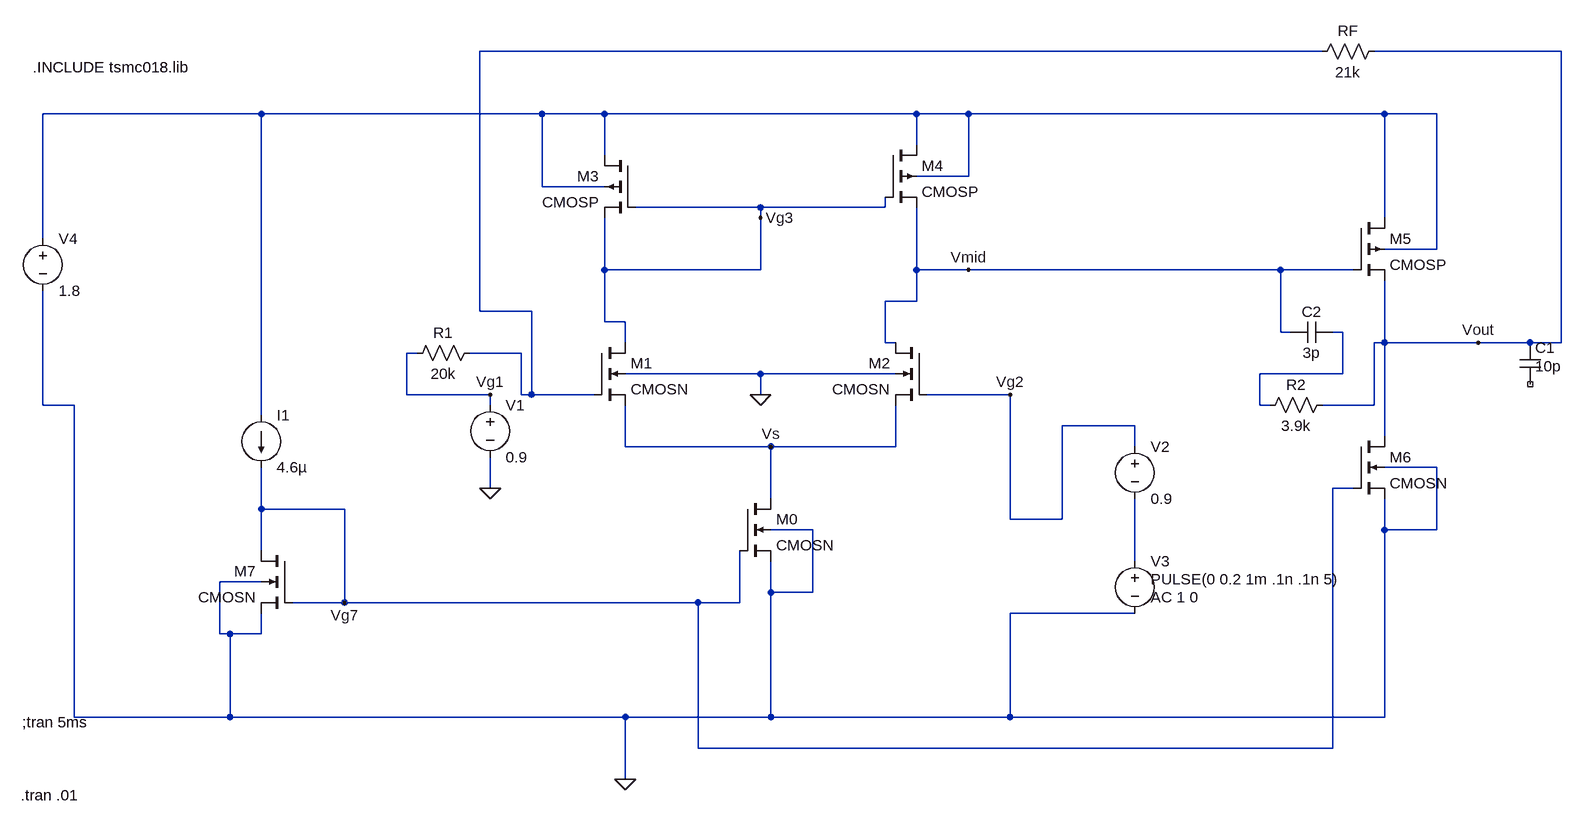
[diagram p0: schematic 2_stage_ota_240102074_closed_loop.asc]
2_stage_ota_240102074_closed_loop.asc, the LTspice schematic file:
Version 4
SHEET 1 2884 1176
WIRE 1696 16 400 16
WIRE 2064 16 1776 16
WIRE 64 112 -272 112
WIRE 496 112 64 112
WIRE 592 112 496 112
WIRE 1072 112 592 112
WIRE 1152 112 1072 112
WIRE 1792 112 1152 112
WIRE 1872 112 1792 112
WIRE 1072 160 1072 112
WIRE 592 176 592 112
WIRE 1152 208 1152 112
WIRE 1152 208 1072 208
WIRE 496 224 496 112
WIRE 592 224 496 224
WIRE 832 256 640 256
WIRE 1024 256 1024 240
WIRE 1024 256 832 256
WIRE 832 272 832 256
WIRE 1792 272 1792 112
WIRE -272 304 -272 112
WIRE 1872 320 1872 112
WIRE 1872 320 1792 320
WIRE 592 352 592 272
WIRE 832 352 832 272
WIRE 832 352 592 352
WIRE 1072 352 1072 256
WIRE 1152 352 1072 352
WIRE 1632 352 1152 352
WIRE 1744 352 1632 352
WIRE 1072 400 1072 352
WIRE 1072 400 1024 400
WIRE 400 416 400 16
WIRE 480 416 400 416
WIRE 592 432 592 352
WIRE 624 432 592 432
WIRE 1632 448 1632 352
WIRE 1648 448 1632 448
WIRE 1728 448 1712 448
WIRE 624 464 624 432
WIRE 1024 464 1024 400
WIRE 1040 464 1024 464
WIRE 1792 464 1792 368
WIRE 1792 464 1776 464
WIRE 1936 464 1792 464
WIRE 2016 464 1936 464
WIRE 2064 464 2064 16
WIRE 2064 464 2016 464
WIRE 304 480 288 480
WIRE 464 480 384 480
WIRE 832 512 624 512
WIRE 1040 512 832 512
WIRE 1728 512 1728 448
WIRE 1728 512 1600 512
WIRE 288 544 288 480
WIRE 416 544 288 544
WIRE 464 544 464 480
WIRE 480 544 480 416
WIRE 480 544 464 544
WIRE 576 544 480 544
WIRE 832 544 832 512
WIRE 1216 544 1088 544
WIRE -272 560 -272 384
WIRE -224 560 -272 560
WIRE 416 560 416 544
WIRE 1600 560 1600 512
WIRE 1616 560 1600 560
WIRE 1776 560 1776 464
WIRE 1776 560 1696 560
WIRE 64 576 64 112
WIRE 1408 592 1296 592
WIRE 1792 608 1792 464
WIRE 624 624 624 560
WIRE 848 624 624 624
WIRE 1040 624 1040 560
WIRE 1040 624 848 624
WIRE 1408 624 1408 592
WIRE 1872 656 1792 656
WIRE 416 688 416 640
WIRE 1744 688 1712 688
WIRE 848 704 848 624
WIRE 64 720 64 656
WIRE 192 720 64 720
WIRE 1216 736 1216 544
WIRE 1296 736 1296 592
WIRE 1296 736 1216 736
WIRE 912 752 848 752
WIRE 1792 752 1792 704
WIRE 1872 752 1872 656
WIRE 1872 752 1792 752
WIRE 64 784 64 720
WIRE 1408 800 1408 704
WIRE 64 832 0 832
WIRE 848 848 848 800
WIRE 912 848 912 752
WIRE 912 848 848 848
WIRE 192 864 192 720
WIRE 192 864 112 864
WIRE 736 864 192 864
WIRE 800 864 800 784
WIRE 800 864 736 864
WIRE 1408 880 1216 880
WIRE 0 912 0 832
WIRE 16 912 0 912
WIRE 64 912 64 880
WIRE 64 912 16 912
WIRE -224 1040 -224 560
WIRE 16 1040 16 912
WIRE 16 1040 -224 1040
WIRE 624 1040 16 1040
WIRE 848 1040 848 848
WIRE 848 1040 624 1040
WIRE 1216 1040 1216 880
WIRE 1216 1040 848 1040
WIRE 1792 1040 1792 752
WIRE 1792 1040 1216 1040
WIRE 736 1088 736 864
WIRE 1712 1088 1712 688
WIRE 1712 1088 736 1088
WIRE 624 1136 624 1040
FLAG 832 544 0
FLAG 416 688 0
FLAG 832 272 Vg3
FLAG 848 624 Vs
FLAG 416 544 Vg1
FLAG 1216 544 Vg2
FLAG 1152 352 Vmid
FLAG 192 864 Vg7
FLAG 624 1136 0
FLAG 1936 464 Vout
SYMBOL cmosp 1024 160 R0
SYMATTR InstName M4
SYMATTR Value2 l=0.9u w=9u
SYMBOL cmosp 640 176 M0
SYMATTR InstName M3
SYMATTR Value2 l=0.9u w=9u
SYMBOL cmosn 1088 464 M0
SYMATTR InstName M2
SYMATTR Value2 l=0.9u w=4.9u
SYMBOL cmosn 576 464 R0
SYMATTR InstName M1
SYMATTR Value2 l=0.9u w=4.9u
SYMBOL cmosn 800 704 R0
SYMATTR InstName M0
SYMATTR Value2 l=0.9u w=9.8u
SYMBOL cmosn 112 784 M0
SYMATTR InstName M7
SYMATTR Value2 l=0.9u w=.98u
SYMBOL current 64 576 R0
WINDOW 123 0 0 Left 2
WINDOW 39 0 0 Left 2
SYMATTR InstName I1
SYMATTR Value 4.6µ
SYMBOL voltage 416 544 R0
WINDOW 123 0 0 Left 2
WINDOW 39 0 0 Left 2
SYMATTR InstName V1
SYMATTR Value 0.9
SYMBOL voltage -272 288 R0
WINDOW 123 0 0 Left 2
WINDOW 39 0 0 Left 2
SYMATTR InstName V4
SYMATTR Value 1.8
SYMBOL voltage 1408 608 R0
WINDOW 123 0 0 Left 2
WINDOW 39 0 0 Left 2
SYMATTR InstName V2
SYMATTR Value 0.9
SYMBOL voltage 1408 784 R0
WINDOW 3 24 44 Left 2
WINDOW 123 24 72 Left 2
WINDOW 39 0 0 Left 2
SYMATTR Value PULSE(0 0.2 1m .1n .1n 5)
SYMATTR Value2 AC 1 0
SYMATTR InstName V3
SYMBOL cmosp 1744 272 R0
SYMATTR InstName M5
SYMATTR Value2 l=0.9u w=8.95u
SYMBOL cmosn 1744 608 R0
SYMATTR InstName M6
SYMATTR Value2 l=0.9u w=4.97u
SYMBOL res 1792 0 R90
WINDOW 0 0 56 VBottom 2
WINDOW 3 32 56 VTop 2
SYMATTR InstName RF
SYMATTR Value 21k
SYMBOL res 400 464 R90
WINDOW 0 0 56 VBottom 2
WINDOW 3 32 56 VTop 2
SYMATTR InstName R1
SYMATTR Value 20k
SYMBOL cap 2000 464 R0
WINDOW 3 24 36 Left 2
SYMATTR Value 10p
SYMATTR InstName C1
SYMBOL cap 1648 464 R270
WINDOW 0 32 32 VTop 2
WINDOW 3 0 32 VBottom 2
SYMATTR InstName C2
SYMATTR Value 3p
SYMBOL res 1712 544 R90
WINDOW 0 0 56 VBottom 2
WINDOW 3 32 56 VTop 2
SYMATTR InstName R2
SYMATTR Value 3.9k
TEXT -288 40 Left 2 !.INCLUDE tsmc018.lib
TEXT -304 1048 Left 2 !;tran 5ms
TEXT -306 1160 Left 2 !.tran .01

The netlist it stands for:
* 2_stage_ota_240102074_closed_loop.asc
M4 N002 Vg3 Vmid N002 CMOSP l=0.9u w=9u
M3 N002 Vg3 Vg3 N002 CMOSP l=0.9u w=9u
M2 Vmid Vg2 Vs 0 CMOSN l=0.9u w=4.9u
M1 Vg3 N001 Vs 0 CMOSN l=0.9u w=4.9u
M0 Vs Vg7 0 0 CMOSN l=0.9u w=9.8u
M7 Vg7 Vg7 0 0 CMOSN l=0.9u w=.98u
I1 N002 Vg7 4.6µ
V1 Vg1 0 0.9
V4 N002 0 1.8
V2 Vg2 N004 0.9
V3 N004 0 PULSE(0 0.2 1m .1n .1n 5) AC 1 0
M5 N002 Vmid Vout N002 CMOSP l=0.9u w=8.95u
M6 Vout Vg7 0 0 CMOSN l=0.9u w=4.97u
RF Vout N001 21k
R1 N001 Vg1 20k
C1 Vout NC_01 10p
C2 Vmid N003 3p
R2 Vout N003 3.9k
.model NMOS NMOS
.model PMOS PMOS
.lib standard.mos
.INCLUDE tsmc018.lib
;tran 5ms
.tran .01
.backanno
.end